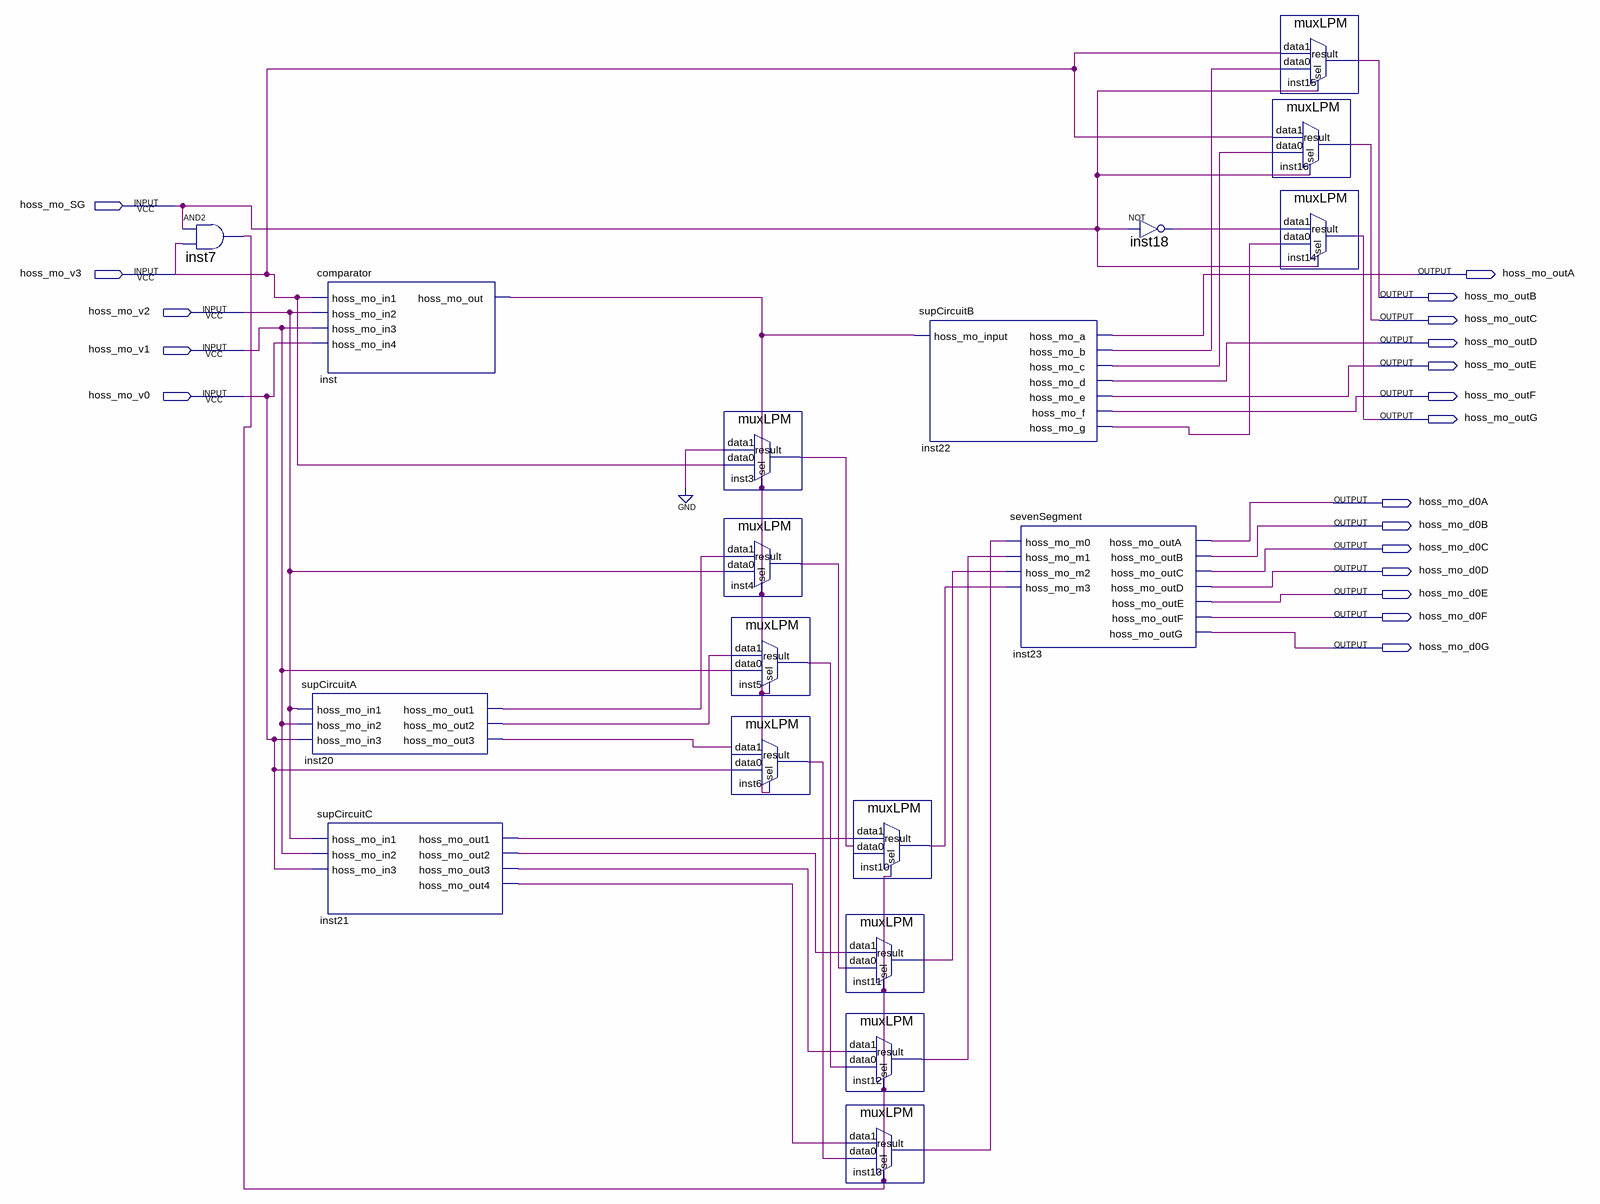
[diagram p0: schematic sheet]
// Quartus schematic svenSegmentDecoder.bdf as structural Verilog: 18 symbols, 19 pins
module svenSegmentDecoder (
  input  hoss_mo_SG,
  input  hoss_mo_v3,
  input  hoss_mo_v2,
  input  hoss_mo_v1,
  input  hoss_mo_v0,
  output hoss_mo_outA,
  output hoss_mo_outB,
  output hoss_mo_outC,
  output hoss_mo_outD,
  output hoss_mo_outE,
  output hoss_mo_outF,
  output hoss_mo_outG,
  output hoss_mo_d0A,
  output hoss_mo_d0B,
  output hoss_mo_d0C,
  output hoss_mo_d0D,
  output hoss_mo_d0E,
  output hoss_mo_d0F,
  output hoss_mo_d0G
);

  wire inst3_result, inst4_result, inst5_result, inst6_result, inst7_out, inst10_result, inst11_result,
       inst12_result, inst13_result, inst18_out, inst20_hoss_mo_out1, inst20_hoss_mo_out2,
       inst20_hoss_mo_out3, inst21_hoss_mo_out1, inst21_hoss_mo_out2, inst21_hoss_mo_out3,
       inst21_hoss_mo_out4, inst22_hoss_mo_b, inst22_hoss_mo_c, inst22_hoss_mo_g, inst_hoss_mo_out;

  and inst7 (inst7_out, hoss_mo_SG, hoss_mo_v3);
  comparator inst (
    .hoss_mo_in1(hoss_mo_v3), .hoss_mo_in2(hoss_mo_v2), .hoss_mo_in3(hoss_mo_v1), .hoss_mo_in4(hoss_mo_v0),
    .hoss_mo_out(inst_hoss_mo_out));
  supCircuitA inst20 (
    .hoss_mo_in1(hoss_mo_v2), .hoss_mo_in2(hoss_mo_v1), .hoss_mo_in3(hoss_mo_v0),
    .hoss_mo_out1(inst20_hoss_mo_out1), .hoss_mo_out2(inst20_hoss_mo_out2), .hoss_mo_out3(inst20_hoss_mo_out3));
  supCircuitC inst21 (
    .hoss_mo_in1(hoss_mo_v2), .hoss_mo_in2(hoss_mo_v1), .hoss_mo_in3(hoss_mo_v0),
    .hoss_mo_out1(inst21_hoss_mo_out1), .hoss_mo_out2(inst21_hoss_mo_out2),
    .hoss_mo_out3(inst21_hoss_mo_out3), .hoss_mo_out4(inst21_hoss_mo_out4));
  muxLPM inst3 (.data1(1'b0), .data0(hoss_mo_v3), .sel(inst_hoss_mo_out), .result(inst3_result));
  muxLPM inst4 (.data1(inst20_hoss_mo_out1), .data0(hoss_mo_v2), .sel(inst_hoss_mo_out), .result(inst4_result));
  muxLPM inst5 (.data1(inst20_hoss_mo_out2), .data0(hoss_mo_v1), .sel(inst_hoss_mo_out), .result(inst5_result));
  muxLPM inst6 (.data1(inst20_hoss_mo_out3), .data0(hoss_mo_v0), .sel(inst_hoss_mo_out), .result(inst6_result));
  muxLPM inst10 (.data1(inst21_hoss_mo_out1), .data0(inst3_result), .sel(inst7_out), .result(inst10_result));
  muxLPM inst11 (.data1(inst21_hoss_mo_out2), .data0(inst4_result), .sel(inst7_out), .result(inst11_result));
  muxLPM inst12 (.data1(inst21_hoss_mo_out3), .data0(inst5_result), .sel(inst7_out), .result(inst12_result));
  muxLPM inst13 (.data1(inst21_hoss_mo_out4), .data0(inst6_result), .sel(inst7_out), .result(inst13_result));
  supCircuitB inst22 (
    .hoss_mo_input(inst_hoss_mo_out), .hoss_mo_a(hoss_mo_outA), .hoss_mo_b(inst22_hoss_mo_b),
    .hoss_mo_c(inst22_hoss_mo_c), .hoss_mo_d(hoss_mo_outD), .hoss_mo_e(hoss_mo_outE),
    .hoss_mo_f(hoss_mo_outF), .hoss_mo_g(inst22_hoss_mo_g));
  sevenSegment inst23 (
    .hoss_mo_m0(inst13_result), .hoss_mo_m1(inst12_result), .hoss_mo_m2(inst11_result),
    .hoss_mo_m3(inst10_result), .hoss_mo_outA(hoss_mo_d0A), .hoss_mo_outB(hoss_mo_d0B),
    .hoss_mo_outC(hoss_mo_d0C), .hoss_mo_outD(hoss_mo_d0D), .hoss_mo_outE(hoss_mo_d0E),
    .hoss_mo_outF(hoss_mo_d0F), .hoss_mo_outG(hoss_mo_d0G));
  not inst18 (inst18_out, hoss_mo_SG);
  muxLPM inst15 (.data1(hoss_mo_v3), .data0(inst22_hoss_mo_b), .sel(hoss_mo_SG), .result(hoss_mo_outB));
  muxLPM inst16 (.data1(hoss_mo_v3), .data0(inst22_hoss_mo_c), .sel(hoss_mo_SG), .result(hoss_mo_outC));
  muxLPM inst14 (.data1(inst18_out), .data0(inst22_hoss_mo_g), .sel(hoss_mo_SG), .result(hoss_mo_outG));
endmodule
